# EAGLE design TSSOP16 a DIP (EAGLE 6.4)
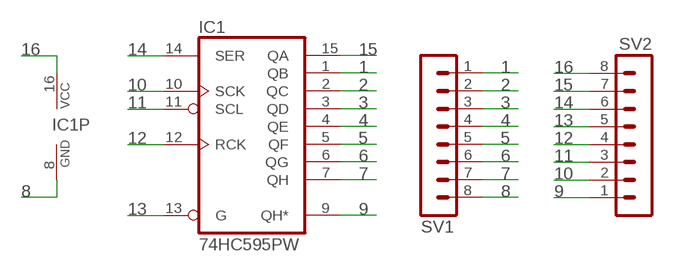
[diagram p0: schematic, sheet 1]

## Parts
IC1  74HC595PW  [TSSOP16]
SV1  MA08-1  [MA08-1]
SV2  MA08-1  [MA08-1]

## Nets
1: IC1.1(QB) SV1.1
2: IC1.2(QC) SV1.2
3: IC1.3(QD) SV1.3
4: IC1.4(QE) SV1.4
5: IC1.5(QF) SV1.5
6: IC1.6(QG) SV1.6
7: IC1.7(QH) SV1.7
8: IC1.8(GND) SV1.8
9: IC1.9(QH*) SV2.1
10: IC1.10(SCK) SV2.2
11: IC1.11(SCL) SV2.3
12: IC1.12(RCK) SV2.4
13: IC1.13(G) SV2.5
14: IC1.14(SER) SV2.6
15: IC1.15(QA) SV2.7
16: IC1.16(VCC) SV2.8

## Library data of the parts
IC1 = 1 MrChunckuee:74*595: 8-bit SHIFT REGISTER, output latch
SV1 SV2 = con-lstb:MA08-1: PIN HEADER; OC_FARNELL: unknown; OC_NEWARK: unknown

## Board
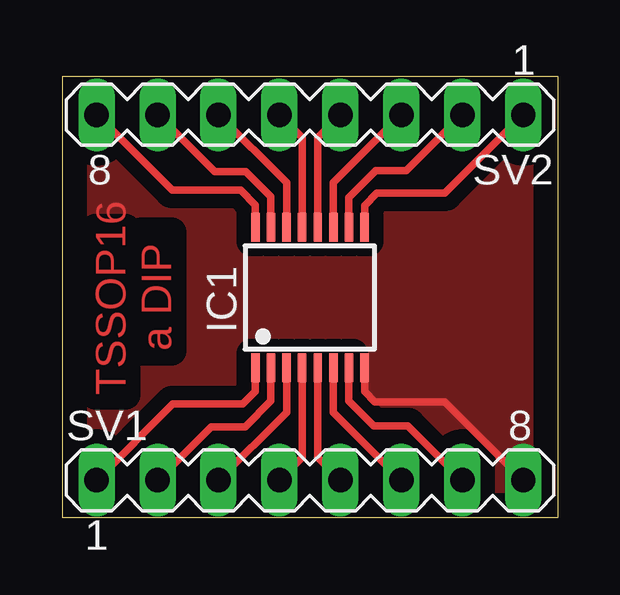
[diagram p1: board, top side]

Size 20.68 x 18.39 mm. Coordinates in mm from the lower left corner, seen from the top.
Outline: 0,0 20.68,0 20.68,18.39 0,18.39 0,0
Copper layers (1*16): Top 0.035mm / dielectric 1.5mm / Bottom 0.035mm
Design rules "default": minimum track width 10mil, minimum drill 24mil, track to track 8mil, track to pad 8mil, pad to pad 8mil, via to via 8mil, smd to smd 8mil, copper to edge 40mil, drill to drill 8mil, minimum pad ring 10mil, minimum via ring 8mil, stop-mask expansion 4mil, vias tented up to drill 0mil, thermal gap 10mil

### Footprints (pad centres in the part's own frame; a part is rotated, then mirrored left to right if it is on the bottom)
TSSOP16 = smd 0.35 x 1.2: 1 -2.275,-2.925; 2 -1.625,-2.925; 3 -0.975,-2.925; 4 -0.325,-2.925; 5 0.325,-2.925; 6 0.975,-2.925; 7 1.625,-2.925; 8 2.275,-2.925; 9 2.275,2.925; 10 1.625,2.925; 11 0.975,2.925; 12 0.325,2.925; 13 -0.325,2.925; 14 -0.975,2.925; 15 -1.625,2.925; 16 -2.275,2.925
MA08-1 = drill 1.016 long: 1 -8.89,0; 2 -6.35,0; 3 -3.81,0; 4 -1.27,0; 5 1.27,0; 6 3.81,0; 7 6.35,0; 8 8.89,0

### Placement (x,y rotation side)
IC1  10.33,9.17 0 top
SV1  10.33,1.55 0 top
SV2  10.33,16.79 180 top

### Tracks (layer width: path | path; a pad name or v marks a point on that pad's centre or on a via)
1
  Top 0.305: IC1.1 8.06,5.26 7.53,4.74 4.62,4.74 SV1.1
2
  Top 0.305: IC1.2 8.71,4.86 7.63,3.78 6.21,3.78 SV1.2
3
  Top 0.305: IC1.3 9.36,4.39 SV1.3
4
  Top 0.305: IC1.4 10.01,2.5 SV1.4
5
  Top 0.305: IC1.5 10.66,2.5 SV1.5
6
  Top 0.305: IC1.6 11.31,4.39 SV1.6
7
  Top 0.305: IC1.7 11.96,4.85 12.98,3.83 14.41,3.83 SV1.7
8
  Top 0.305: IC1.8 12.61,5.25 13.03,4.83 15.95,4.83 SV1.8
  pour Top (isolate 0.61, no thermals): -1.27,19.05 21.59,19.05 21.59,0 21.59,-1.27 -1.27,-1.27
9
  Top 0.305: IC1.9 12.61,13.01 13.12,13.53 15.95,13.53 SV2.1
10
  Top 0.305: IC1.10 11.96,13.35 13.06,14.46 14.35,14.46 SV2.2
11
  Top 0.305: IC1.11 11.31,13.96 SV2.3
12
  Top 0.305: IC1.12 10.66,15.85 SV2.4
13
  Top 0.305: IC1.13 10.01,15.85 SV2.5
14
  Top 0.305: IC1.14 9.36,13.96 SV2.6
15
  Top 0.305: IC1.15 8.71,13.37 7.66,14.42 6.36,14.42 SV2.7
16
  Top 0.305: IC1.16 8.06,13.03 7.45,13.64 4.59,13.64 SV2.8

### Text on the board
Top: a DIP | TSSOP16